# EAGLE design SparkFun_I2C_Expander-PCF8575 (EAGLE 7.2.0)
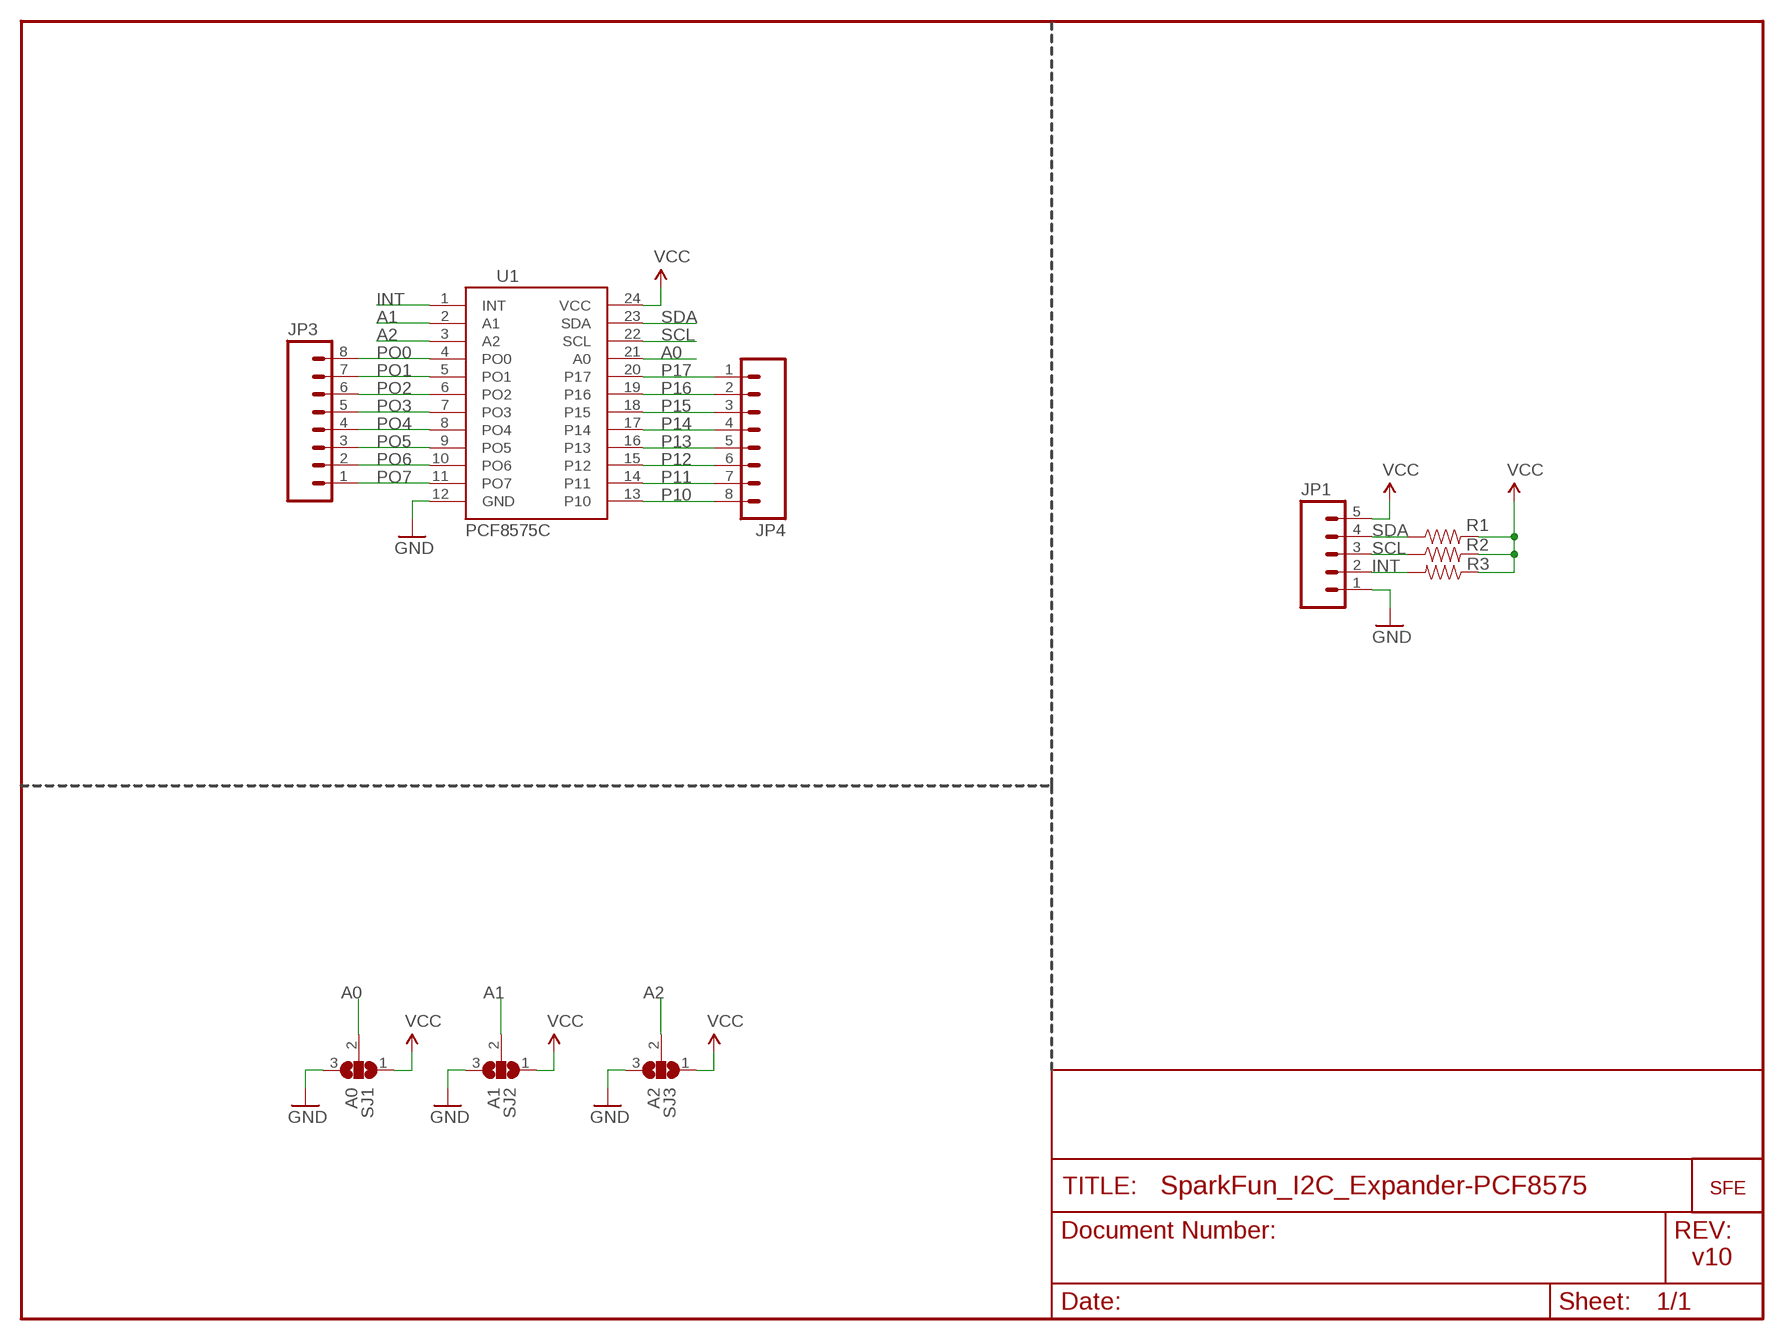
[diagram p0: schematic, sheet 1]

## Parts
JP1  M05  [1X05]
JP3  M08  [1X08]
JP4  M08  [1X08]
R1  RESISTOR0402  [C0402]
R2  RESISTOR0402  [C0402]
R3  RESISTOR0402  [C0402]
SJ1  A0  SOLDERJUMPER_2WAYS  [SJ_3]
SJ2  A1  SOLDERJUMPER_2WAYS  [SJ_3]
SJ3  A2  SOLDERJUMPER_2WAYS  [SJ_3]
U1  PCF8575C  [SO-24DW]
U$2  LOGO-SFENEW  [SFE-NEW-WEBLOGO]

## Nets
A0: SJ1.2 U1.21(A0)
A1: SJ2.2 U1.2(A1)
A2: SJ3.2 U1.3(A2)
GND: JP1.1 SJ1.3 SJ2.3 SJ3.3 U1.12(GND)
INT: JP1.2 R3.2 U1.1(INT)
P10: JP4.8 U1.13(P10)
P11: JP4.7 U1.14(P11)
P12: JP4.6 U1.15(P12)
P13: JP4.5 U1.16(P13)
P14: JP4.4 U1.17(P14)
P15: JP4.3 U1.18(P15)
P16: JP4.2 U1.19(P16)
P17: JP4.1 U1.20(P17)
PO0: JP3.8 U1.4(PO0)
PO1: JP3.7 U1.5(PO1)
PO2: JP3.6 U1.6(PO2)
PO3: JP3.5 U1.7(PO3)
PO4: JP3.4 U1.8(PO4)
PO5: JP3.3 U1.9(PO5)
PO6: JP3.2 U1.10(PO6)
PO7: JP3.1 U1.11(PO7)
SCL: JP1.3 R2.1 U1.22(SCL)
SDA: JP1.4 R1.1 U1.23(SDA)
VCC: JP1.5 R1.2 R2.2 R3.1 SJ1.1 SJ2.1 SJ3.1 U1.24(VCC)

## Notes on the sheet
- v10

## Library data of the parts
JP1 = SparkFun:M05: Header 5 Standard 5-pin 0.1" header. Use with straight break away headers (SKU : PRT-00116), right angle break away headers (PRT-00553), swiss pins (PRT-00743), machine pins (PRT-00117), and female headers (PRT-00115). Molex polarized connector foot print use with SKU : PRT-08230 with associated crimp pins and housings.
JP3 JP4 = SparkFun:M08: Header 8 Standard 8-pin 0.1" header. Use with straight break away headers (SKU : PRT-00116), right angle break away headers (PRT-00553), swiss pins (PRT-00743), machine pins (PRT-00117), and female headers (PRT-00115).
R1-R3 = SparkFun:RESISTOR: Resistor Basic schematic elements and footprints for 0603, 1206, and PTH 1/10th watt (small) resistors.
SJ1-SJ3 = SparkFun:SOLDERJUMPER_2WAY: Solder Jumper 2 way solder jumper
U1 = SparkFun:PCF8575C: PCF8575C I/O Expander.
U$2 = SparkFun:LOGO-SFE: Spark Fun Electronics PCB Logo This is the standard Spark Fun Electronics PCB logo.

## Board
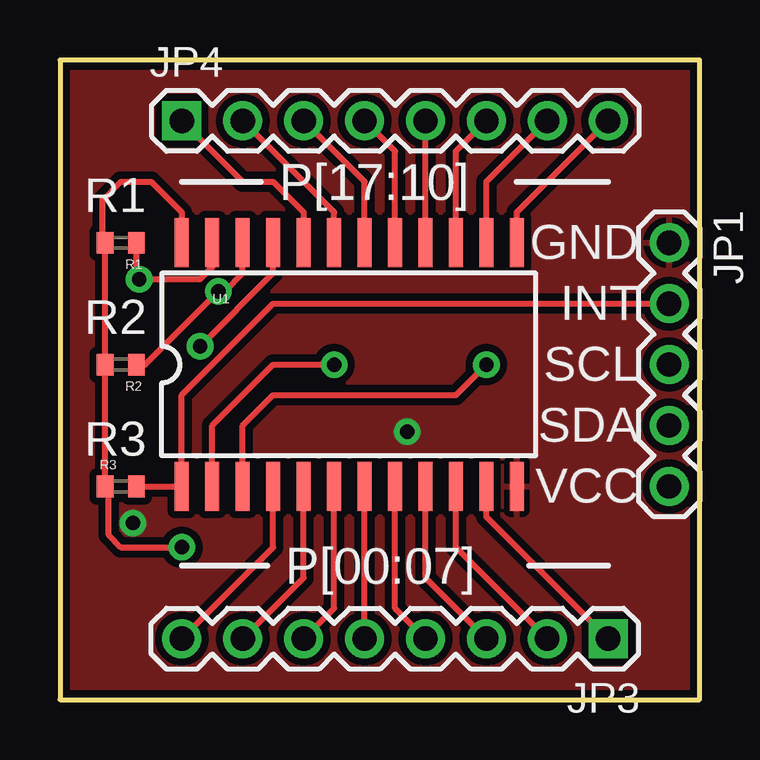
[diagram p1: board, top side]
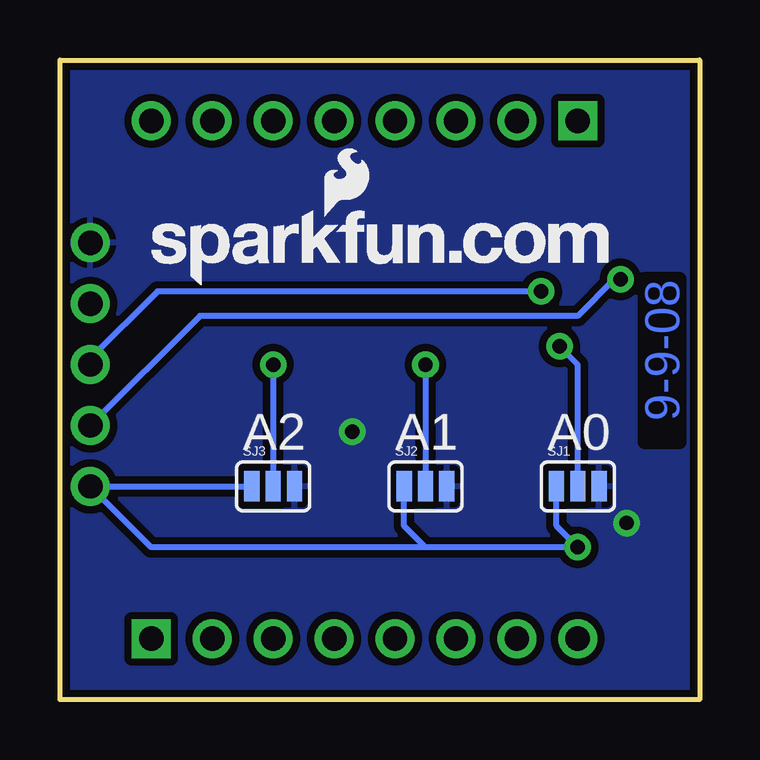
[diagram p2: board, bottom side, seen from below]

Size 26.67 x 26.67 mm. Coordinates in mm from the lower left corner, seen from the top.
Outline: 0,0 26.67,0 26.67,26.67 0,26.67 0,0
Copper layers (1*16): Top 0.0356mm / dielectric 1.5011mm / Bottom 0.0356mm
Design rules "default *": minimum track width 8mil, minimum drill 20mil, track to track 8mil, track to pad 8mil, pad to pad 8mil, via to via 8mil, smd to smd 8mil, copper to edge 10mil, drill to drill 8mil, minimum pad ring 12mil, minimum via ring 10mil, stop-mask expansion 4mil, vias tented up to drill 24mil, thermal gap 10mil

### Footprints (pad centres in the part's own frame; a part is rotated, then mirrored left to right if it is on the bottom)
1X05 = drill 1.016: 1 0,0; 2 2.54,0; 3 5.08,0; 4 7.62,0; 5 10.16,0
1X08 = drill 1.016 square: 1 0,0 | drill 1.016: 2 2.54,0; 3 5.08,0; 4 7.62,0; 5 10.16,0; 6 12.7,0; 7 15.24,0; 8 17.78,0
C0402 = smd 0.7 x 0.9: 1 -0.65,0; 2 0.65,0
SJ_3 = smd 0.635 x 1.27: 1 -0.889,0; 2 0,0; 3 0.889,0
SO-24DW = smd 0.584 x 2.032: 1 -6.35,-5.08; 2 -5.08,-5.08; 3 -3.81,-5.08; 4 -2.54,-5.08; 5 -1.27,-5.08; 6 0,-5.08; 7 1.27,-5.08; 8 2.54,-5.08; 9 3.81,-5.08; 10 5.08,-5.08; 11 6.35,-5.08; 12 7.62,-5.08; 13 7.62,5.08; 14 6.35,5.08; 15 5.08,5.08; 16 3.81,5.08; 17 2.54,5.08; 18 1.27,5.08; 19 0,5.08; 20 -1.27,5.08; 21 -2.54,5.08; 22 -3.81,5.08; 23 -5.08,5.08; 24 -6.35,5.08

### Placement (x,y rotation side)
JP1  25.4,19.05 270 top
JP3  22.86,2.54 180 top
JP4  5.08,24.13 0 top
R1  2.54,19.05 180 top
R2  2.54,13.97 180 top
R3  2.54,8.89 0 top
SJ1  5.08,8.89 0 bottom
SJ2  11.43,8.89 0 bottom
SJ3  17.78,8.89 0 bottom
U1  11.43,13.97 0 top
U$2  22.86,17.27 0 bottom

### Tracks (layer width: path | path; a pad name or v marks a point on that pad's centre or on a via)
A0  (via drill 0.6)
  Top 0.254: U1.21 8.89,17.78 v5.84,14.73
  Bottom 0.254: SJ1.2 5.08,13.97 v5.84,14.73
A1  (via drill 0.6)
  Top 0.254: v11.43,13.97 8.89,13.97 6.35,11.43 U1.2
  Bottom 0.254: v11.43,13.97 SJ2.2
A2  (via drill 0.6)
  Top 0.254: v17.78,13.97 16.51,12.7 8.89,12.7 7.62,11.43 U1.3
  Bottom 0.254: v17.78,13.97 SJ3.2
GND  (via drill 0.6)
  other vias: 14.48,11.18 3.05,7.37
  pour Top (isolate 0.305): 0,26.67 0,0 26.67,0 26.67,26.67
  pour Bottom (isolate 0.305): 0,26.67 0,0 26.67,0 26.67,26.67
INT
  Top 0.254: R3.2 U1.1 5.08,12.7 8.89,16.51 JP1.2
P10
  Top 0.254: U1.13 19.05,20.32 JP4.8
P11
  Top 0.254: U1.14 17.78,21.59 JP4.7
P12
  Top 0.254: U1.15 16.51,22.86 JP4.6
P13
  Top 0.254: U1.16 JP4.5
P14
  Top 0.254: U1.17 13.97,22.86 JP4.4
P15
  Top 0.254: U1.18 12.7,21.59 JP4.3
P16
  Top 0.254: U1.19 11.43,20.32 JP4.2
P17
  Top 0.254: U1.20 10.16,20.32 8.89,21.59 7.62,21.59 JP4.1
PO0
  Top 0.254: U1.4 8.89,6.35 JP3.8
PO1
  Top 0.254: U1.5 10.16,5.08 JP3.7
PO2
  Top 0.254: U1.6 11.43,3.81 JP3.6
PO3
  Top 0.254: JP3.5 U1.7
PO4
  Top 0.254: U1.8 13.97,3.81 JP3.4
PO5
  Top 0.254: U1.9 15.24,5.08 JP3.3
PO6
  Top 0.254: U1.10 16.51,6.35 JP3.2
PO7
  Top 0.254: U1.11 17.78,7.62 JP3.1
SCL  (via drill 0.6)
  Top 0.254: R2.1 3.56,13.97 v6.6,17.02 6.86,17.02 7.62,17.78 U1.22
  Bottom 0.254: JP1.3 25.4,14.22 22.61,17.02 v6.6,17.02
SDA  (via drill 0.6)
  Top 0.254: R1.1 3.19,17.64 v3.3,17.53 5.84,17.53 6.35,18.03 U1.23
  Bottom 0.254: JP1.4 20.83,16 5.08,16 3.56,17.53 v3.3,17.53
VCC  (via drill 0.6)
  Top 0.254: 2.03,8.89 R3.1 | 2.03,8.89 1.89,9.03 R2.2 1.78,13.97 1.89,14.08 R1.2 1.78,19.05 1.78,20.83 2.54,21.59 3.81,21.59 5.08,20.32 U1.24 | 2.03,8.89 2.03,6.86 2.54,6.35 v5.08,6.35
  Bottom 0.254: SJ3.1 JP1.5 22.86,6.35 11.43,6.35 | SJ1.1 5.97,7.24 v5.08,6.35 11.43,6.35 | SJ2.1 12.32,7.24 11.43,6.35

### Text on the board
Bottom: 9-9-08
tPlace: P[17:10] | R1 | GND | INT | R2 | SCL | SDA | R3 | VCC | P[00:07]
bPlace: A0 | A1 | A2